# EasyEDA Pro project 四层板_Test.eprj

# Schematic Schematic1
Create Date: 2023-07-28; Page Name: P1; Project Name: 四层板_Test; Schematic Name: Schematic1; Update Date: 2023-07-28; Company: 嘉立创EDA; Page Size: A4; Version: V1.0
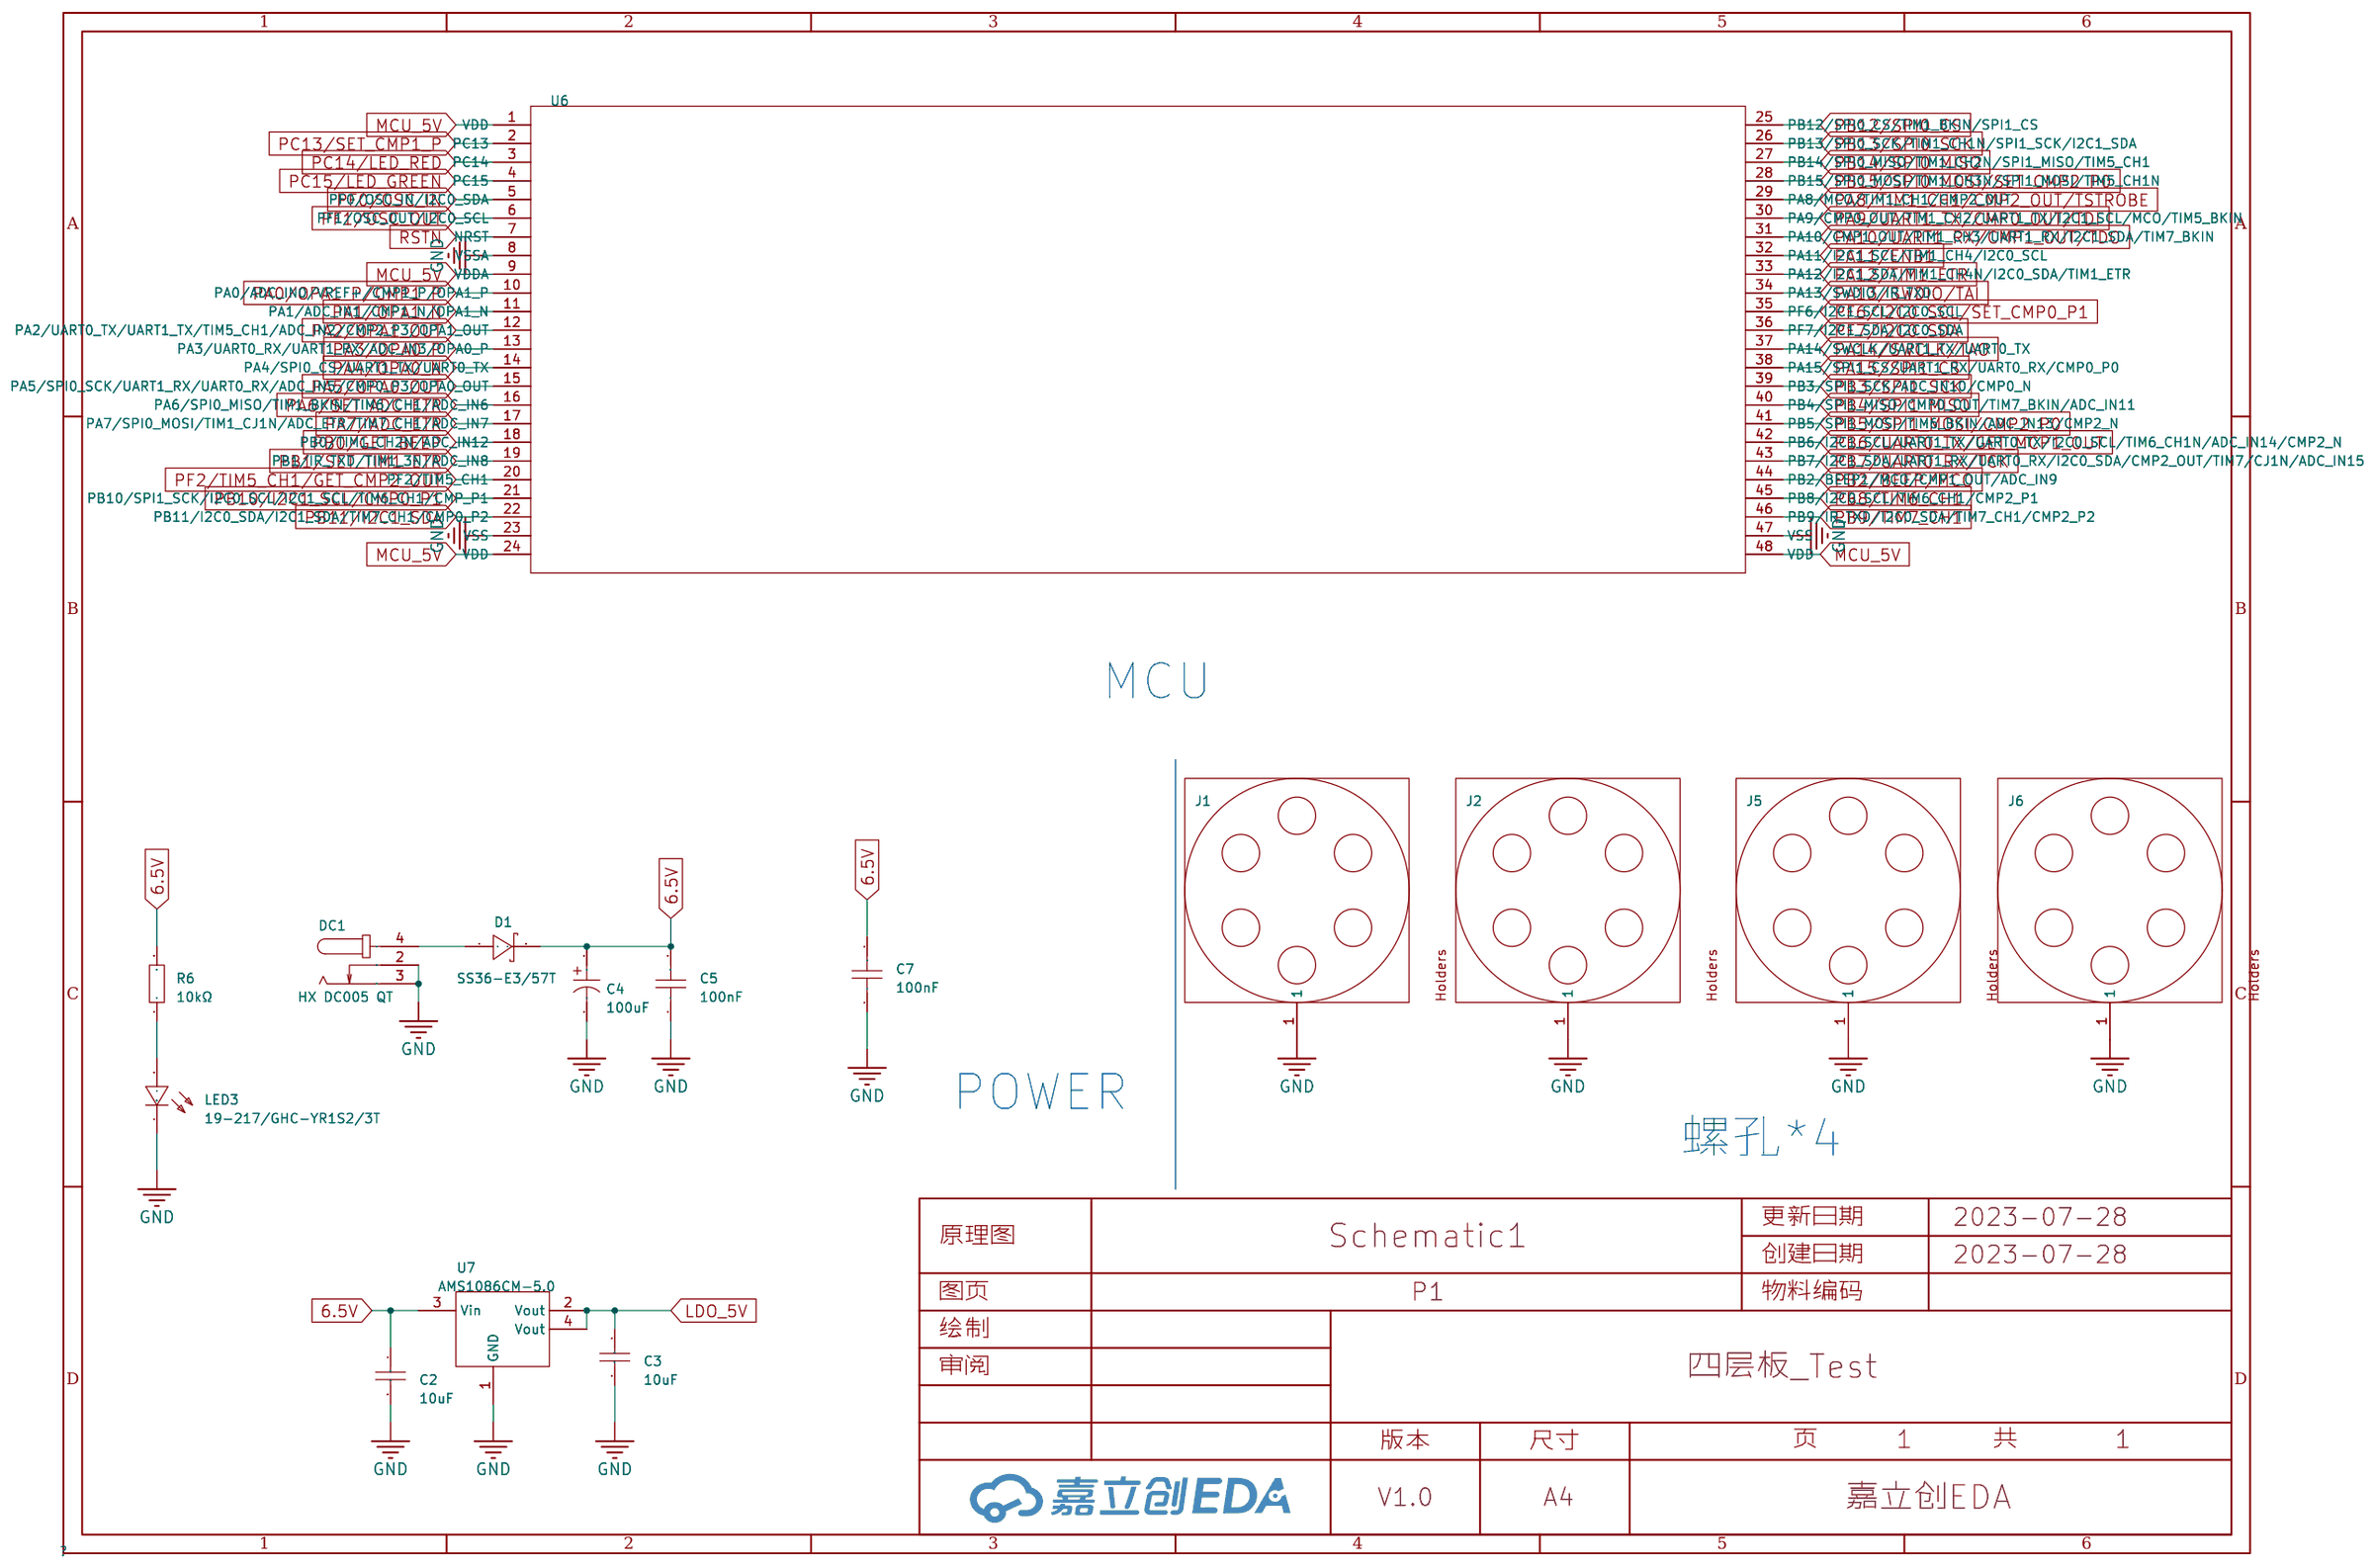
[diagram p0: schematic sheet]

## Parts
C2  10uF  [C1206]
C3  10uF  [C1206]
C4  100uF  [CAP-SMD_BD6.3-L6.6-W6.6-LS7.6-FD-1]
C5  100nF  [C0603]
C7  100nF  [C0603]
D1  SS36-E3/57T  [SMC_L7.1-W6.2-LS8.1-R-RD]
DC1  HX DC005 QT  [DC-IN-TH_HANXIA_HX-DC005-QT]
J1  -  [DEMO板安装孔]
J2  -  [DEMO板安装孔]
J5  -  [DEMO板安装孔]
J6  -  [DEMO板安装孔]
LED3  19-217/GHC-YR1S2/3T  [LED0603-RD]
R6  10kΩ  [R0603]
U6  PT32A030C8T7  [LQFP-48_L7.0-W7.0-P0.50-LS9.0-BL-EP5.4]
U7  AMS1086CM-5.0  [TO-263-3_L8.6-W10.2-P2.54-LS14.4-TL]

## Library data of the parts
C2 C3 = CL31A106KBHNNNE: 容值:10uF;精度:±10%;额定电压:50V;材质(温度系数):X5R;; LCSC Part Name: 10uF ±10% 50V; Supplier Part: C13585; Manufacturer: SAMSUNG(三星); Supplier Footprint: 1206; JLCPCB Part Class: Basic Part; Datasheet: https://atta.szlcsc.com/upload/public/pdf/source/20160103/1457707668742.pdf; Supplier: LCSC; Tolerance: ±10%; Voltage Rated: 50V; Temperature Coefficient: X5R
C4 = RVE100UF35V67RV0072: 容值:100uF;额定电压:35V;电容体直径:-;电容体长度:-;纹波电流:-;等效串联电阻:-;工作寿命:-;; LCSC Part Name: 100uF 35V; Supplier Part: C2836437; Manufacturer: KNSCHA(科尼盛); Supplier Footprint: SMD,6.3x7.7mm; JLCPCB Part Class: Extended Part; Datasheet: https://atta.szlcsc.com/upload/public/pdf/source/20220719/B52EB46F8A1558448ED03D8B4CB3C24F.pdf; Supplier: LCSC; Rated Voltage: 35V
C5 C7 = CL10B104KB8NNNC: 容值:100nF;精度:±10%;额定电压:50V;材质(温度系数):X7R;; LCSC Part Name: 100nF ±10% 50V; Supplier Part: C1591; Manufacturer: SAMSUNG(三星); Supplier Footprint: 0603; JLCPCB Part Class: Extended Part; Datasheet: https://atta.szlcsc.com/upload/public/pdf/source/20160103/1457707680512.pdf; Supplier: LCSC; Tolerance: ±10%; Voltage Rated: 50V; Temperature Coefficient: X7R
D1 = SS36-E3/57T: 直流反向耐压（Vr）:60V;平均整流电流（Io）:3A;正向压降（Vf）:750mV @ 3A;; Supplier Part: C35722; Manufacturer: VISHAY(威世); Supplier Footprint: SMC(DO-214AB); JLCPCB Part Class: Basic Part; Datasheet: https://atta.szlcsc.com/upload/public/pdf/source/20151007/1457707426323.pdf; Supplier: LCSC
DC1 = HX DC005 QT: 连接器类型:DC插座;安装方式:卧插;额定电流:1A;额定电压:12V;工作温度范围:-25℃~+85℃;; LCSC Part Name: DC插座; Supplier Part: C5184829; Manufacturer: hanxia(韩下); Supplier Footprint: 插件; JLCPCB Part Class: Extended Part; Datasheet: https://atta.szlcsc.com/upload/public/pdf/source/20220930/72F2DABD42189BF434FA6ABB0C092A1C.pdf; Supplier: LCSC; Connector Type: DC插座; Mounting Style: 卧插; Current Rating (Max): 1A; Voltage Rating (Max): 12V; Operating Temperature Range: -25℃~+85℃
J1 J2 J5 J6 = 螺孔_3.1X6MM
LED3 = 19-217/GHC-YR1S2/3T: 发光颜色:翠绿;二极管配置:-;透镜颜色:无色透明;主波长:520nm~535nm;峰值波长:518nm;色温:-;测试电流:20mA;功率:110mW;发光角度:120°;安装方式:-;工作温度:-40℃~+85℃;; LCSC Part Name: 翠绿 520nm~535nm; Supplier Part: C72043; Manufacturer: EVERLIGHT(亿光); Supplier Footprint: 0603; JLCPCB Part Class: Basic Part; Datasheet: https://atta.szlcsc.com/upload/public/pdf/source/20160507/1462613613780.pdf; Supplier: LCSC; Emitted Color: 翠绿; Lens Color: 无色透明; Dominant Wavelength: 520nm~535nm; Peak Wavelength: 518nm; Forward Current: 20mA; Power Dissipation: 110mW; Viewing Angle: 120°; Operating Temperature: -40℃~+85℃
R6 = 0603WAF1002T5E: 电阻类型:厚膜电阻;阻值:10kΩ;精度:±1%;功率:100mW;温度系数:±100ppm/℃;最大工作电压:75V;工作温度范围:-55℃~+155℃;; LCSC Part Name: 10kΩ ±1% 100mW; Supplier Part: C25804; Manufacturer: UNI-ROYAL(厚声); Supplier Footprint: 0603; JLCPCB Part Class: Basic Part; Datasheet: https://atta.szlcsc.com/upload/public/pdf/source/20200306/C422600_1E6D84923E4A46A82E41ADD87F860B5C.pdf; Supplier: LCSC; Type: 厚膜电阻; Tolerance: ±1%; Power(Watts): 100mW; Temperature Coefficient: ±100ppm/℃; Overload Voltage (Max): 75V; Operating Temperature Range: -55℃~+155℃
U6 = PT32A030C8T7
U7 = AMS1086CM-5.0: 输出类型:固定;输出极性:正;最大输入电压:15V;输出电压:5V;输出电流:1.5A;电源纹波抑制比(PSRR):68dB@(120Hz);; LCSC Part Name: 输入15V 输出5V 1.5A; Supplier Part: C27631; Manufacturer: AMS; Supplier Footprint: TO-263-3; JLCPCB Part Class: Extended Part; Datasheet: https://atta.szlcsc.com/upload/public/pdf/source/20140314/1457707017583.pdf; Supplier: LCSC; Output Type: 固定; Output Polarity: 正; Number of Outputs: 1; Maximum Input Voltage: 15V; Output Voltage: 5V; Dropout Voltage: 1.5V@(1.5A); Output Current: 1.5A; Power Supply Rejection Ratio (PSRR): 68dB@(120Hz)

## Nets
6.5V: C2.1 C4.1 C5.2 C7.2 D1.2(K) R6.2 U7.3(Vin)
GND: C2.2 C3.1 C4.2 C5.1 C7.1 DC1.2 DC1.3 J1.1 J2.1 J5.1 J6.1 LED3.1(C) U6.8(VSSA) U6.23(VSS) U6.47(VSS) U7.1(GND)
LDO_5V: C3.2 U7.2(Vout) U7.4(Vout)
MCU_5V: U6.1(VDD) U6.9(VDDA) U6.24(VDD) U6.48(VDD)
PA0/OPA1_P/CMP1_P: U6.10(PA0/ADC_IN0/VREF+/CMP1_P/OPA1_P)
PA1/OPA1_N: U6.11(PA1/ADC_IN1/CMP1_N/OPA1_N)
PA2/OPA1_OUT: U6.12(PA2/UART0_TX/UART1_TX/TIM5_CH1/ADC_IN2/CMP2_P3/OPA1_OUT)
PA3/OPA0_P: U6.13(PA3/UART0_RX/UART1_RX/ADC_IN3/OPA0_P)
PA4/OPA0_N: U6.14(PA4/SPI0_CS/UART1_TX/UART0_TX)
PA5/OPA0_OUT: U6.15(PA5/SPI0_SCK/UART1_RX/UART0_RX/ADC_IN5/CMP0_P3/OPA0_OUT)
PA6/SET_ADC_ETR: U6.16(PA6/SPI0_MISO/TIM1_BKIN/TIM6/CH1/ADC_IN6)
PA7/ADC_ETR: U6.17(PA7/SPI0_MOSI/TIM1_CJ1N/ADC_ETR/TIM7_CH1/ADC_IN7)
PA8/TIM1_CH1/CMP2_OUT/TSTROBE: U6.29(PA8/MCO/TIM1_CH1/CMP2_OUT)
PA9/UART1_TX/CMP0_OUT/TDI: U6.30(PA9/CMP0_OUT/TIM1_CH2/UART1_TX/I2C1_SCL/MCO/TIM5_BKIN)
PA10/UART1_RX/CMP1_OUT/TDO: U6.31(PA10/CMP1_OUT/TIM1_CH3/UART1_RX/I2C1_SDA/TIM7_BKIN)
PA11/ENB1: U6.32(PA11/I2C1_SCL/TIM1_CH4/I2C0_SCL)
PA12/TIM1_ETR: U6.33(PA12/I2C1_SDA/TIM1_CH4N/I2C0_SDA/TIM1_ETR)
PA13/SWDIO/TAI: U6.34(PA13/SWDIO/IR_TXD)
PA14/SWCLK/TAO: U6.37(PA14/SWCLK/UART1_TX/UART0_TX)
PA15/SPI1_CS: U6.38(PA15/SPI1_CS/UART1_RX/UART0_RX/CMP0_P0)
PB0/GET_BEEP: U6.18(PB0/TIM1_CH2N/ADC_IN12)
PB1/SET_TIM1_ETR: U6.19(PB1/IR_TXD/TIM1_3N/ADC_IN8)
PB2/BEEP/MCO: U6.44(PB2/BEEP1/MCO/CMP1_OUT/ADC_IN9)
PB3/SPI1_SCK: U6.39(PB3/SPI1_SCK/ADC_IN10/CMP0_N)
PB4/SPI1_MISO: U6.40(PB4/SPI1_MISO/CMP0_OUT/TIM7_BKIN/ADC_IN11)
PB5/SPI1_MOSI/CMP2_P0: U6.41(PB5/SPI1_MOSI/TIM6_BKIN/ADC_IN13/CMP2_N)
PB6/UART0_TX/GET_MCP1_OUT: U6.42(PB6/I2C1_SCL/UART1_TX/UART0_TX/I2C0_SCL/TIM6_CH1N/ADC_IN14/CMP2_N)
PB7/UART0_RX/TCK: U6.43(PB7/I2C1_SDA/UART1_RX/UART0_RX/I2C0_SDA/CMP2_OUT/TIM7/CJ1N/ADC_IN15)
PB8/TIM6_CH1: U6.45(PB8/I2C0_SCL/TIM6_CH1/CMP2_P1)
PB9/TIM7_CH1: U6.46(PB9/IR_TXD/I2C0_SDA/TIM7_CH1/CMP2_P2)
PB10/I2C1_SCL/CMP0_P1: U6.21(PB10/SPI1_SCK/I2C0_SCL/I2C1_SCL/TIM6_CH1/CMP_P1)
PB11/I2C1_SDA: U6.22(PB11/I2C0_SDA/I2C1_SDA/TIM7_CH1/CMP0_P2)
PB12/SPI0_CS: U6.25(PB12/SPI0_CS/TIM1_BKIN/SPI1_CS)
PB13/SPI0_SCK: U6.26(PB13/SPI0_SCK/TIM1_CH1N/SPI1_SCK/I2C1_SDA)
PB14/SPI0_MISO: U6.27(PB14/SPI0_MISO/TIM1_CH2N/SPI1_MISO/TIM5_CH1)
PB15/SPI0_MOSI/SET_CMP2_P0: U6.28(PB15/SPI0_MOSI/TIM1_CH3N/SPI1_MOSI/TIM5_CH1N)
PC13/SET_CMP1_P: U6.2(PC13)
PC14/LED_RED: U6.3(PC14)
PC15/LED_GREEN: U6.4(PC15)
PF0/OSC_IN: U6.5(PF0/OSC_IN/I2C0_SDA)
PF1/OSC_OUT: U6.6(PF1/OSC_OUT/I2C0_SCL)
PF2/TIM5_CH1/GET_CMP2_OUT: U6.20(PF2/TIM5_CH1)
PF6/I2C0_SCL/SET_CMP0_P1: U6.35(PF6/I2C1_SCL/I2C0_SCL)
PF7/I2C0_SDA: U6.36(PF7/I2C1_SDA/I2C0_SDA)
RSTN: U6.7(NRST)
$1N1100: D1.1(A) DC1.4
$1N1115: LED3.2(A) R6.1

## Notes on the sheet
- MCU
- POWER
- 螺孔*4

# Board PCB1
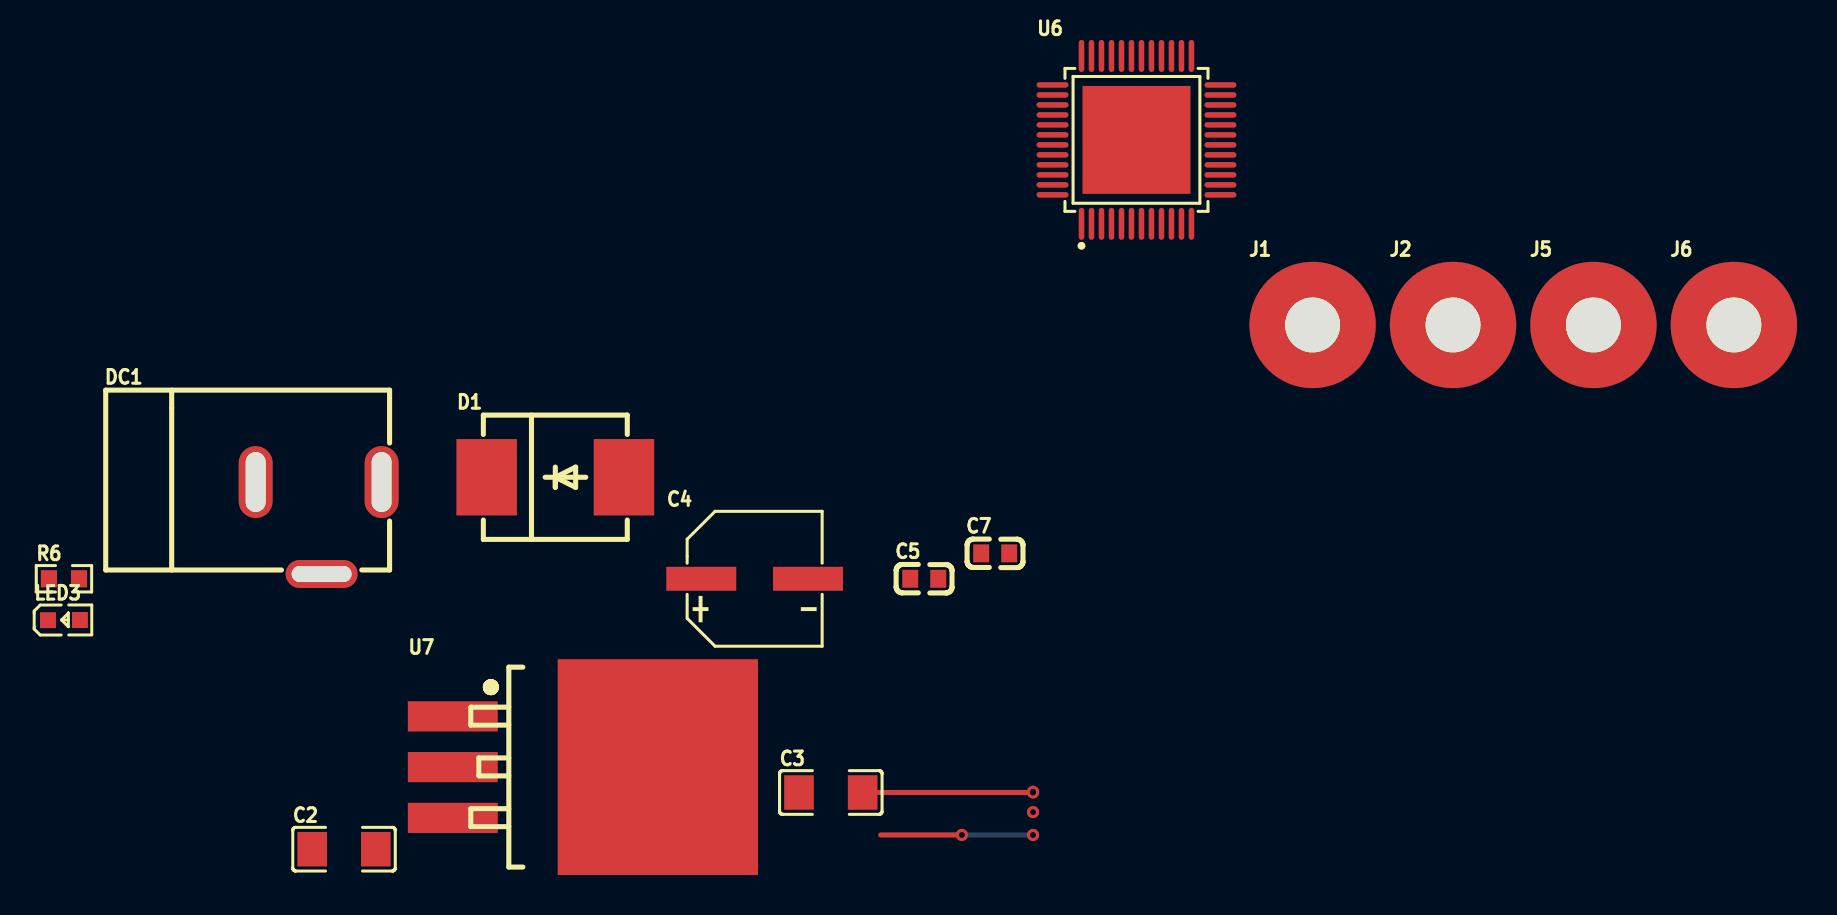
[diagram p1: board, top side]
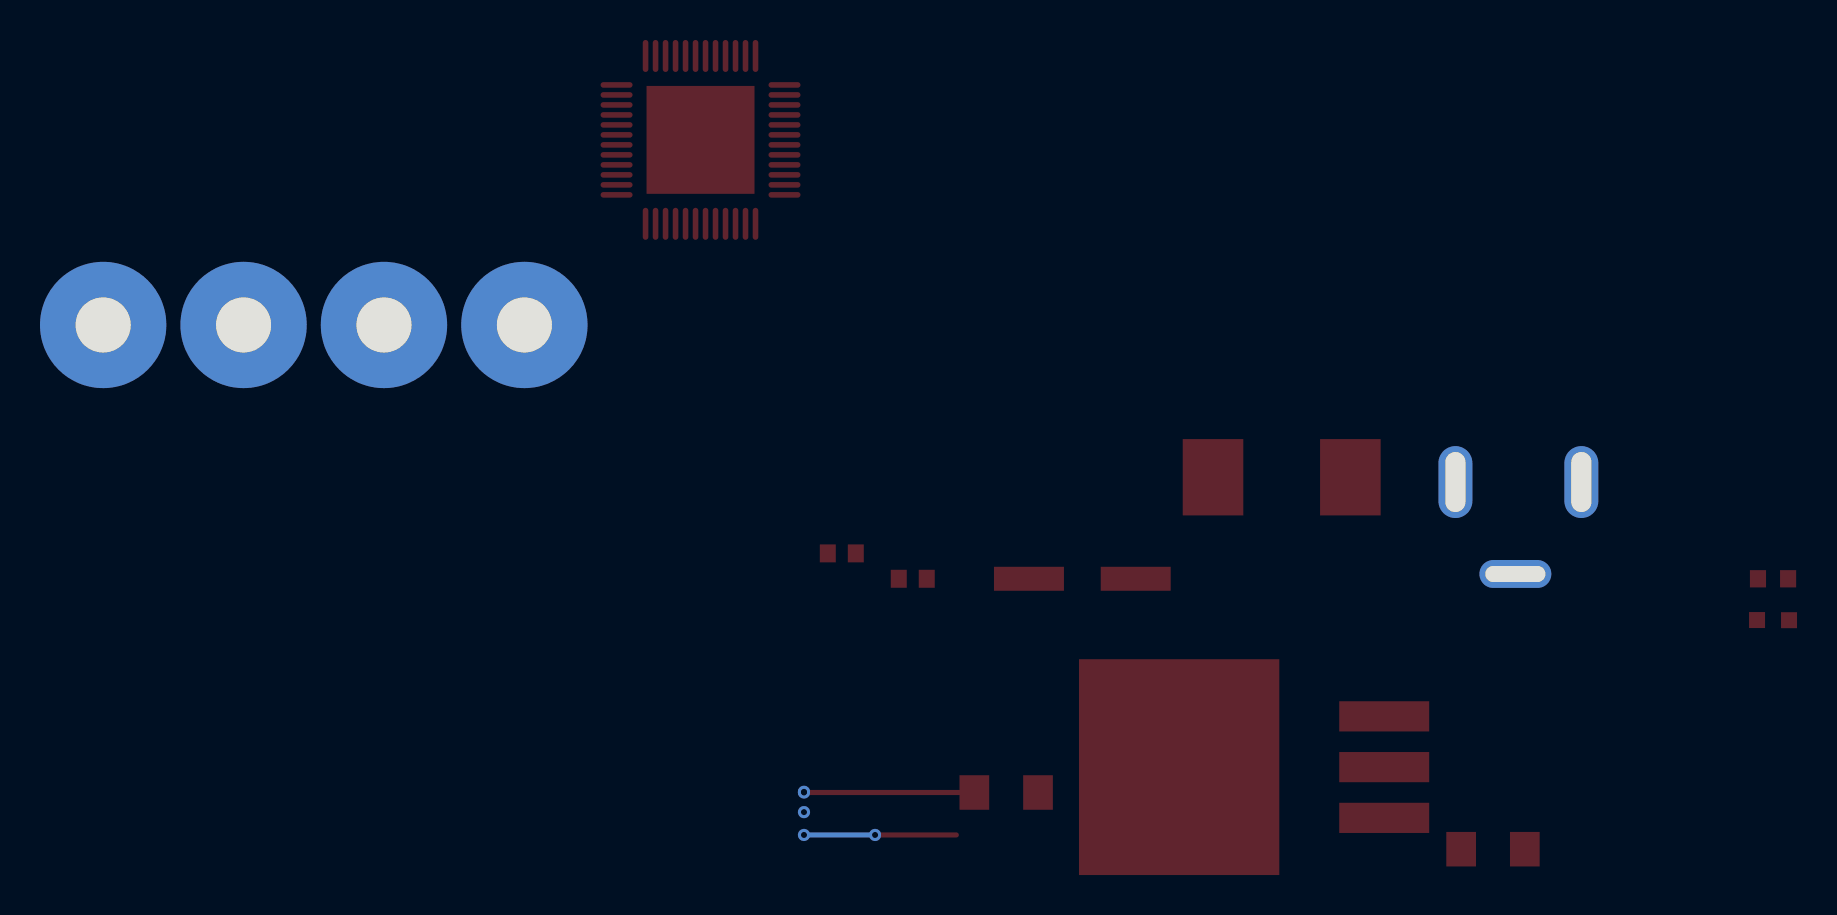
[diagram p2: board, bottom side, seen from below]

No outline. copper layers: Top Layer, Inner1, Inner2, Bottom Layer. Coordinates in mm from the lowest, leftmost part position.
Stack: Top Layer 0.035mm / Dielectric1 0.48mm PP er 4.5 / Inner1 0.035mm / Dielectric2 0.48mm FR4 er 4.5 / Inner2 0.035mm / Dielectric3 0.48mm PP er 4.5 / Bottom Layer 0.035mm

## Design rules (mm)
template: JLCPCB Capability(Two Layers Board)
spacing copperThickness1oz (default): track to track 0.102, other pairs 0.152 to 0.3
spacing copperThickness2oz: track to track 0.203, other pairs 0.152 to 0.3
track width copperThickness1oz (default): min 0.127, default 0.254, max 2.54
track width copperThickness2oz: min 0.203, default 0.254, max 2.54
differential pair differentialPair (default): width min 0.127, default 0.254, max 2.54; gap min 0.152, default 0.152
via viaSize (default): diameter min 0.5, default 0.61, max 10; hole min 0.3, default 0.305, max 6.3

## Placement (name value [footprint] x y rotation side)
C2  10uF  [C1206]  14.01 0 0 top
C3  10uF  [C1206]  38.36 2.84 0 top
C4  100uF  [CAP-SMD_BD6.3-L6.6-W6.6-LS7.6-FD-1]  34.55 13.53 0 top
C5  100nF  [C0603]  43.03 13.53 0 top
C7  100nF  [C0603]  46.58 14.8 0 top
D1  SS36-E3/57T  [SMC_L7.1-W6.2-LS8.1-R-RD]  24.58 18.61 0 top
DC1  HX DC005 QT  [DC-IN-TH_HANXIA_HX-DC005-QT]  12.74 16.07 0 top
J1  -  [DEMO板安装孔]  62.46 26.23 0 top
J2  -  [DEMO板安装孔]  69.48 26.23 0 top
J5  -  [DEMO板安装孔]  76.51 26.23 0 top
J6  -  [DEMO板安装孔]  83.53 26.23 0 top
LED3  19-217/GHC-YR1S2/3T  [LED0603-RD]  0 11.46 0 top
R6  10kΩ  [R0603]  0 13.53 0 top
U6  PT32A030C8T7  [LQFP-48_L7.0-W7.0-P0.50-LS9.0-BL-EP5.4]  53.65 35.49 0 top
U7  AMS1086CM-5.0  [TO-263-3_L8.6-W10.2-P2.54-LS14.4-TL]  24.58 4.11 0 top

## Footprints (pads in the part's own frame, mm; a bottom-side part is the same pattern mirrored in y, then rotated)
C0603
  rect 0.8x0.9 smd: 1(-0.7,0) 2(0.7,0)
C1206
  rect 1.485x1.728 smd: 1(-1.593,0) 2(1.593,0)
CAP-SMD_BD6.3-L6.6-W6.6-LS7.6-FD-1
  rect 3.5x1.2 smd: 1(-2.67,0) 2(2.67,0)
DC-IN-TH_HANXIA_HX-DC005-QT
  oval 3.6x1.4 hole 3x0.8: 2(0.15,-2.3)
  oval 1.7x3.6 hole 1x3: 3(-3.15,2.3) 4(3.15,2.3)
DEMO板安装孔
  round 6.32 hole 2.75: 1(0,0)
LED0603-RD
  rect 0.8x0.8 smd: 1(-0.799,-0.004) 2(0.799,0.004)
LQFP-48_L7.0-W7.0-P0.50-LS9.0-BL-EP5.4
  oval 0.28x1.6 smd: 1(-2.75,-4.2) 2(-2.25,-4.2) 3(-1.75,-4.2) 4(-1.25,-4.2) 5(-0.75,-4.2) 6(-0.25,-4.2) 7(0.25,-4.2) 8(0.75,-4.2) 9(1.25,-4.2) 10(1.75,-4.2) 11(2.25,-4.2) 12(2.75,-4.2) 25(2.75,4.2) 26(2.25,4.2) 27(1.75,4.2) 28(1.25,4.2) 29(0.75,4.2) 30(0.25,4.2) 31(-0.25,4.2) 32(-0.75,4.2) 33(-1.25,4.2) 34(-1.75,4.2) 35(-2.25,4.2) 36(-2.75,4.2)
  oval 1.6x0.28 smd: 13(4.2,-2.75) 14(4.2,-2.25) 15(4.2,-1.75) 16(4.2,-1.25) 17(4.2,-0.75) 18(4.2,-0.25) 19(4.2,0.25) 20(4.2,0.75) 21(4.2,1.25) 22(4.2,1.75) 23(4.2,2.25) 24(4.2,2.75) 37(-4.2,2.75) 38(-4.2,2.25) 39(-4.2,1.75) 40(-4.2,1.25) 41(-4.2,0.75) 42(-4.2,0.25) 43(-4.2,-0.25) 44(-4.2,-0.75) 45(-4.2,-1.25) 46(-4.2,-1.75) 47(-4.2,-2.25) 48(-4.2,-2.75)
  rect 5.4x5.4 smd: 49(0,0)
R0603
  rect 0.806x0.864 smd: 1(-0.753,0) 2(0.753,0)
SMC_L7.1-W6.2-LS8.1-R-RD
  rect 3.03x3.82 smd: 1(3.435,0) 2(-3.435,0)
TO-263-3_L8.6-W10.2-P2.54-LS14.4-TL
  rect 4.5x1.511 smd: 1(-5.128,2.54) 2(-5.128,0) 3(-5.128,-2.54)
  rect 10.02x10.8 smd: 4(5.129,0)

## Nets
As in the schematic.

Pads without a net: U6 49

## Via types
v1: diameter 0.61, hole 0.305, Top Layer to Bottom Layer, 5 vias

## Routing (per net, layer and track width the routed paths; a pad name or vN(x,y) marks a point on that pad's centre or on a via; arc(x,y) is an arc through that point)
LDO_5V: length 18.3
  Top Layer w0.254: v1(44.92,0.71) 40.85,0.71 ; C3.2 v1(48.47,2.84)
  Inner1 w0.254: v1(48.47,2.87) v1(48.47,1.86)
  Inner2 w0.254: v1(48.47,1.86) v1(48.47,0.71)
  Bottom Layer w0.254: v1(48.47,2.84) v1(48.47,2.87) ; v1(48.47,0.71) v1(44.92,0.71)
